# Altium schematic sheet IPOD_LCD.SchDoc
size A3
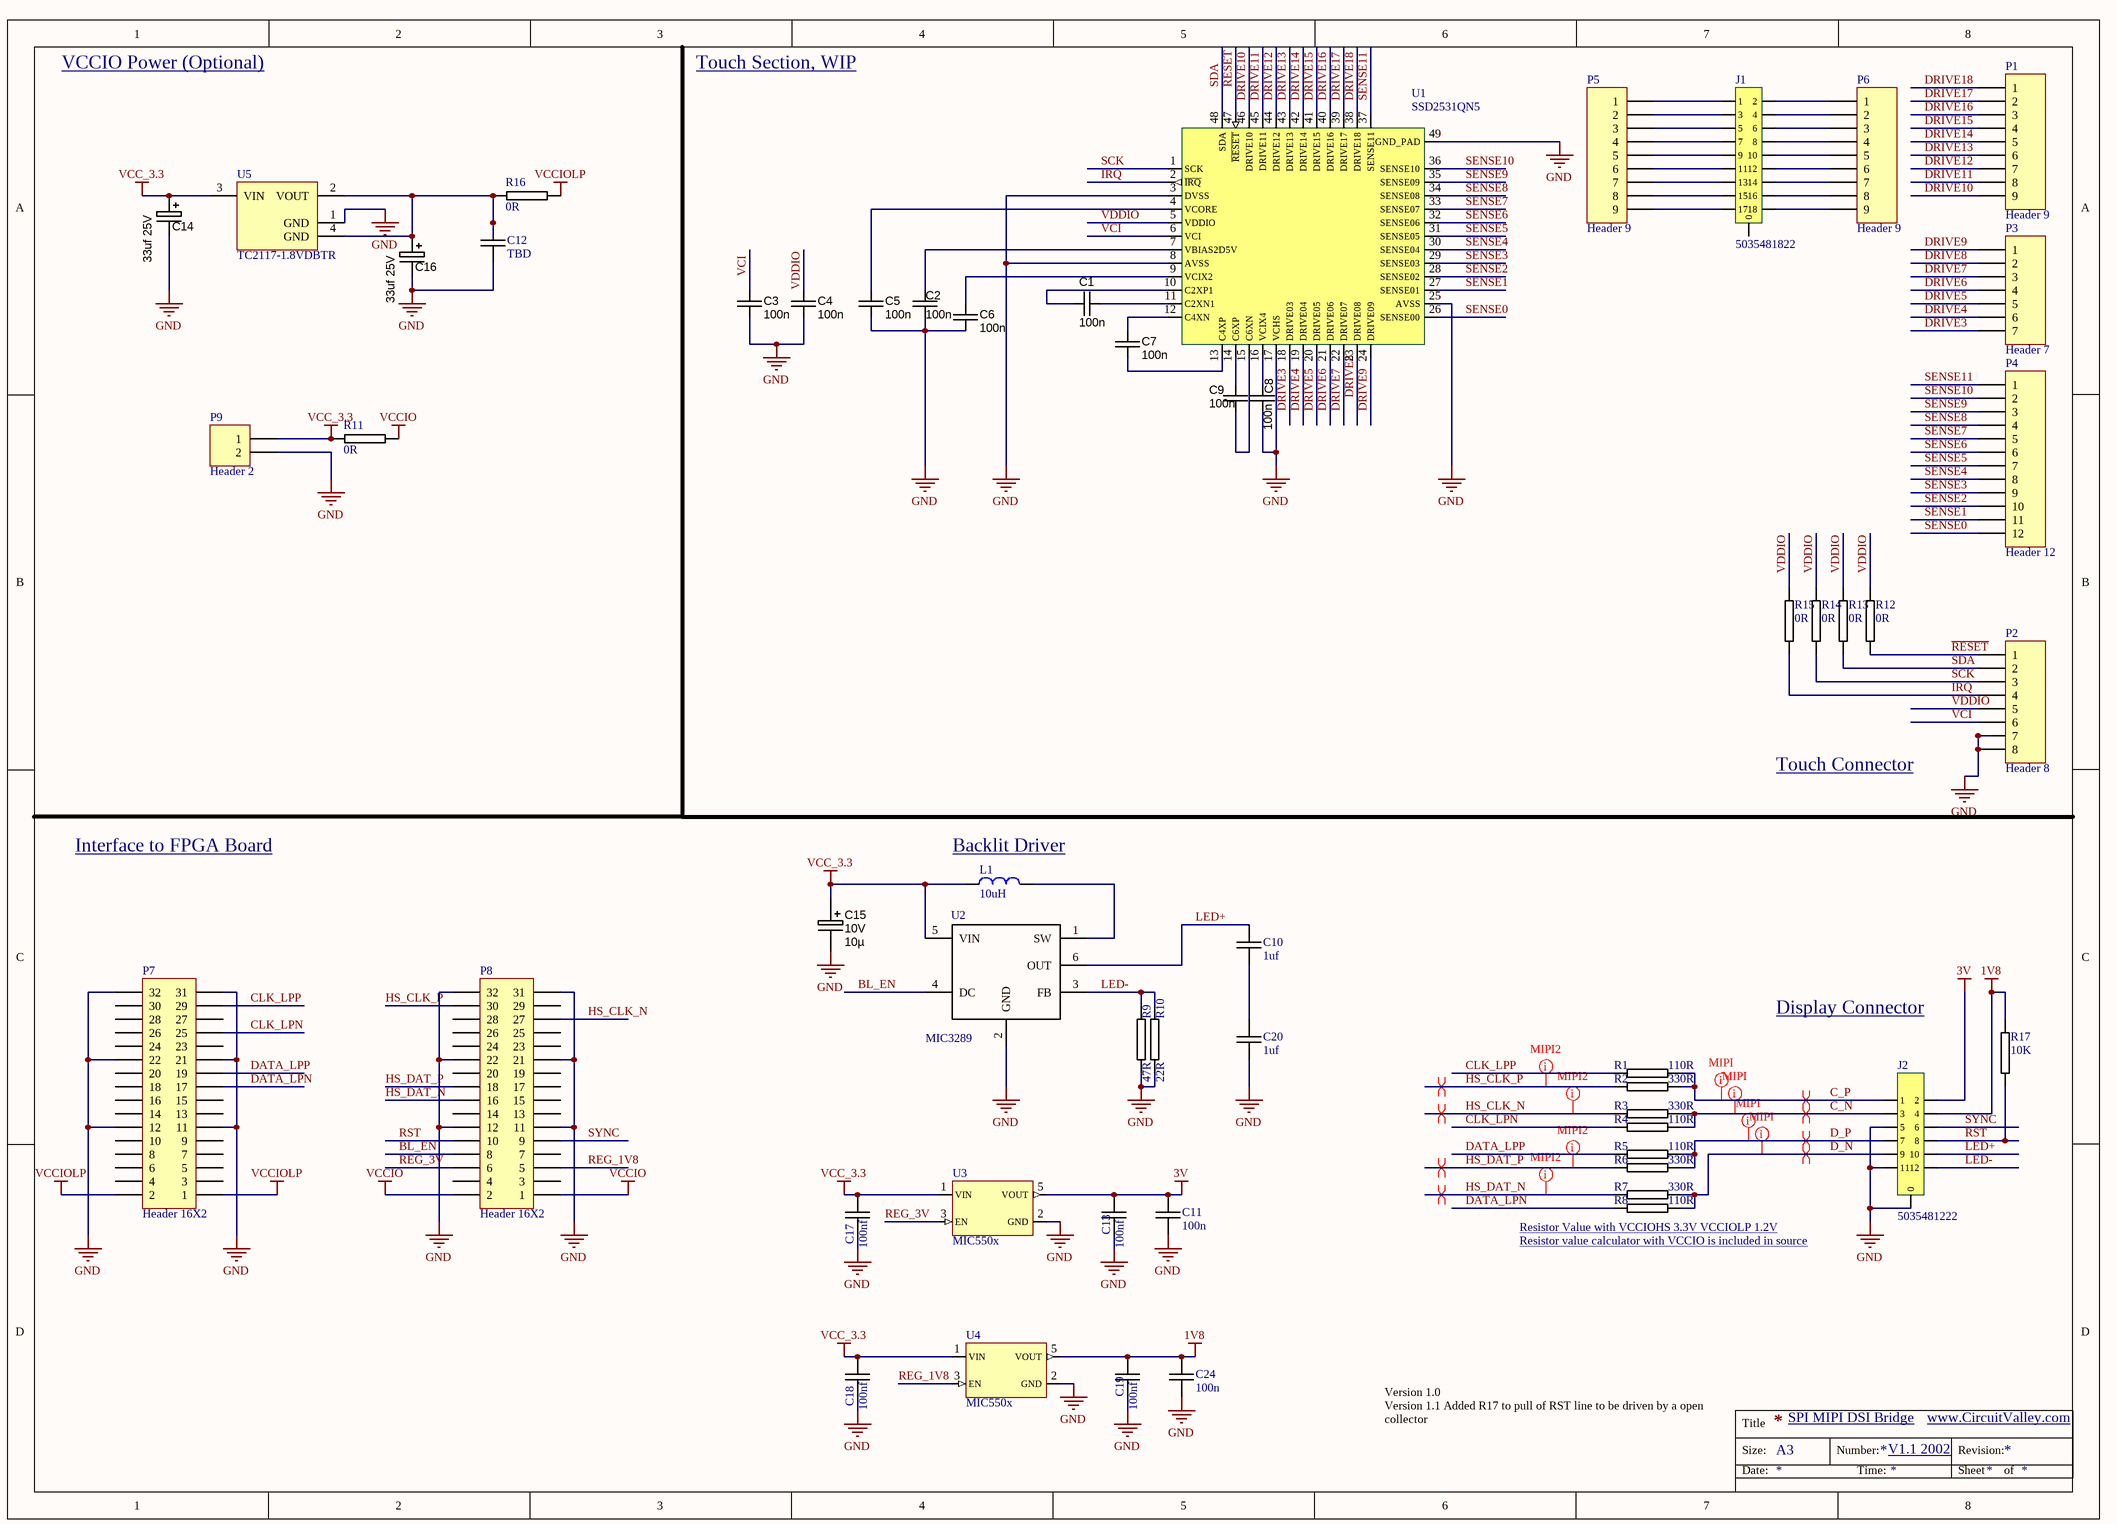
[diagram p0: IPOD_LCD.SchDoc]

## Parts
C1  100n  [CAPC1608N]
C2  100n  [CAPC1608N]
C3  100n  [CAPC1608N]
C4  100n  [CAPC1608N]
C5  100n  [CAPC1608N]
C6  100n  [CAPC1608N]
C7  100n  [CAPC1608N]
C8  100n  [CAPC1608N]
C9  100n  [CAPC1608N]
C10  1uf  [0805C-TBD]
C11  100n  [0805C-TBD]
C12  TBD  [0805C-TBD]
C13  100nf  [0603C-GENERIC]
C14  value 33uf 25V  [CAPMP7343X310N]  (hidden comment: 33uf 20V D)
C15  Ratings: 10V  [CAPMP3528X210N]  (hidden comment: 10µ)
C16  value 33uf 25V  [CAPMP7343X310N]  (hidden comment: 33uf 20V D)
C17  100nf  [0603C-GENERIC]
C18  100nf  [0603C-GENERIC]
C19  100nf  [0603C-GENERIC]
C20  1uf  [0805C-TBD]
C24  100n  [0805C-TBD]
J1  5035481822  [5035481822]
J2  5035481222  [5035481222]
L1  10uH  [IFSC-1515AH-01]
P1  Header 9  [HDR1X9]
P2  Header 8  [HDR1X8]
P3  Header 7  [HDR1X7]
P4  Header 12  [HDR1X12]
P5  Header 9  [HDR1X9]
P6  Header 9  [HDR1X9]
P7  Header 16X2  [HDR2X16]
P8  Header 16X2  [HDR2X16]
P9  Header 2  [HDR1X2]
R1  110R  [0805R-GENERIC]
R2  330R  [0805R-GENERIC]
R3  330R  [0805R-GENERIC]
R4  110R  [0805R-GENERIC]
R5  110R  [0805R-GENERIC]
R6  330R  [0805R-GENERIC]
R7  330R  [0805R-GENERIC]
R8  110R  [0805R-GENERIC]
R9  47R  [0805R-GENERIC]
R10  22R  [0805R-GENERIC]
R11  0R  [0805R-GENERIC]
R12  0R  [0805R-GENERIC]
R13  0R  [0805R-GENERIC]
R14  0R  [0805R-GENERIC]
R15  0R  [0805R-GENERIC]
R16  0R  [0805R-GENERIC]
R17  10K  [0805R-GENERIC]
U1  SSD2531QN5  [QFN48_6x6_0.4]
U2  MIC3289  [SOT23-6]
U3  MIC550x  [SOT23-5]
U4  MIC550x  [SOT23-5]
U5  TC2117-1.8VDBTR  [SOT-223-DB3_N]

## Nets
1V8: C19.2 C24.1 J2.4 R17.2 U4.5(VOUT)
3V: C11.1 C13.2 J2.2 U3.5(VOUT)
GND: C2.2 C3.2 C4.2 C5.2 C6.2 C8.2 C11.2 C12.2 C13.1 C14.2 C15.2 C16.2 C17.1 C18.1 C19.1 C20.2 C24.2 J2.0 J2.5 J2.11 P2.7 P2.8 P7.11 P7.12 P7.21 P7.22 P7.31 P7.32 P8.11 P8.12 P8.21 P8.22 P8.31 P8.32 P9.2 R9.1 R10.1 U1.3(DVSS) U1.8(AVSS) U1.17(VCHS) U1.25(AVSS) U1.49(GND_PAD) U2.2(GND) U3.2(GND) U4.2(GND) U5.1(GND)
VCC_3.3: C14.1 C15.1 C17.2 C18.2 L1.1 P9.1 R11.1 U2.5(VIN) U3.1(VIN) U4.1(VIN) U5.3(VIN)
VCCIO: P8.1 P8.2 R11.2
VCCIOLP: P7.1 P7.2 R16.1
BL_EN: P8.8 U2.4(DC)
C_N: J2.3 R3.2 R4.2
C_P: J2.1 R1.2 R2.2
CLK_LPN: P7.25 R4.1
CLK_LPP: P7.29 R1.1
D_N: J2.9 R7.2 R8.2
D_P: J2.7 R5.2 R6.2
DATA_LPN: P7.17 R8.1
DATA_LPP: P7.19 R5.1
DRIVE3: P3.7 U1.18(DRIVE03)
DRIVE4: P3.6 U1.19(DRIVE04)
DRIVE5: P3.5 U1.20(DRIVE05)
DRIVE6: P3.4 U1.21(DRIVE06)
DRIVE7: P3.3 U1.22(DRIVE07)
DRIVE8: P3.2 U1.23(DRIVE08)
DRIVE9: P3.1 U1.24(DRIVE09)
DRIVE10: P1.9 U1.46(DRIVE10)
DRIVE11: P1.8 U1.45(DRIVE11)
DRIVE12: P1.7 U1.44(DRIVE12)
DRIVE13: P1.6 U1.43(DRIVE13)
DRIVE14: P1.5 U1.42(DRIVE14)
DRIVE15: P1.4 U1.41(DRIVE15)
DRIVE16: P1.3 U1.40(DRIVE16)
DRIVE17: P1.2 U1.39(DRIVE17)
DRIVE18: P1.1 U1.38(DRIVE18)
HS_CLK_N: P8.27 R3.1
HS_CLK_P: P8.30 R2.1
HS_DAT_N: P8.16 R7.1
HS_DAT_P: P8.18 R6.1
~{IRQ}: P2.4 R15.1 U1.2(~{IRQ})
LED+: C10.1 J2.10 U2.6(OUT)
LED-: J2.12 R9.2 R10.2 U2.3(FB)
~{RESET}: P2.1 R12.1 U1.47(~{RESET})
REG_1V8: P8.5 U4.3(EN)
REG_3V: P8.6 U3.3(EN)
RST: J2.8 P8.10 R17.1
SCK: P2.3 R14.1 U1.1(SCK)
SDA: P2.2 R13.1 U1.48(SDA)
SENSE0: P4.12 U1.26(SENSE00)
SENSE1: P4.11 U1.27(SENSE01)
SENSE2: P4.10 U1.28(SENSE02)
SENSE3: P4.9 U1.29(SENSE03)
SENSE4: P4.8 U1.30(SENSE04)
SENSE5: P4.7 U1.31(SENSE05)
SENSE6: P4.6 U1.32(SENSE06)
SENSE7: P4.5 U1.33(SENSE07)
SENSE8: P4.4 U1.34(SENSE08)
SENSE9: P4.3 U1.35(SENSE09)
SENSE10: P4.2 U1.36(SENSE10)
SENSE11: P4.1 U1.37(SENSE11)
SYNC: J2.6 P8.9
VCI: C3.1 P2.6 U1.6(VCI)
VDDIO: C4.1 P2.5 R12.2 R13.2 R14.2 R15.2 U1.5(VDDIO)
NetC1_1: C1.1 U1.11(C2XN1)
NetC1_2: C1.2 U1.10(C2XP1)
NetC2_1: C2.1 U1.7(VBIAS2D5V)
NetC5_1: C5.1 U1.4(VCORE)
NetC6_1: C6.1 U1.9(VCIX2)
NetC7_1: C7.1 U1.12(C4XN)
NetC7_2: C7.2 U1.13(C4XP)
NetC8_1: C8.1 U1.16(VCIX4)
NetC9_1: C9.1 U1.14(C6XP)
NetC9_2: C9.2 U1.15(C6XN)
NetC10_2: C10.2 C20.1
NetC12_1: C12.1 C16.1 R16.2 U5.2(VOUT) U5.4(GND)
NetJ1_1: J1.1 P5.1
NetJ1_2: J1.2 P6.1
NetJ1_3: J1.3 P5.2
NetJ1_4: J1.4 P6.2
NetJ1_5: J1.5 P5.3
NetJ1_6: J1.6 P6.3
NetJ1_7: J1.7 P5.4
NetJ1_8: J1.8 P6.4
NetJ1_9: J1.9 P5.5
NetJ1_10: J1.10 P6.5
NetJ1_11: J1.11 P5.6
NetJ1_12: J1.12 P6.6
NetJ1_13: J1.13 P5.7
NetJ1_14: J1.14 P6.7
NetJ1_15: J1.15 P5.8
NetJ1_16: J1.16 P6.8
NetJ1_17: J1.17 P5.9
NetJ1_18: J1.18 P6.9
NetL1_2: L1.2 U2.1(SW)

Not connected (* = marked no-connect by the designer): J1 19(0); P7 3 4 5 6 7 8 9 10 13 14 15 16 18 20 23 24 26 27 28 30; P8 3 4 7 13 14 15 17 19 20 23 24 25 26 28 29

## Layout directives
net class MIPI: C_N, C_P, D_N, D_P
differential pair: C_N, C_P, D_N, D_P, HS_CLK_N, HS_CLK_P, HS_DAT_N, HS_DAT_P
net class MIPI2: HS_CLK_N, HS_CLK_P, HS_DAT_N, HS_DAT_P

## Notes on the sheet
- VCCIO Power (Optional)
- Touch Section, WIP
- Touch Connector
- Interface to FPGA Board
- (near L1) Backlit Driver
- Display Connector
- (near R8) Resistor Value with VCCIOHS 3.3V VCCIOLP 1.2V
- Resistor value calculator with VCCIO is included in source
- Version 1.0
  Version 1.1 Added R17 to pull of RST line to be driven by a open collector
- SPI MIPI DSI Bridge
- V1.1 2002
- www.CircuitValley.com
- Title
- Size:
- Date:
- A3
- Number:
- Time:
- Revision:
- Sheet
- of

## Library data of the parts
C1-C9 = CAPC_10p_0603_NP0_1%_50V: Capacitor SMD Cer 10pF 5% 50V NP0 0603; Manufacturer 1: Murata Electronics North America; Manufacturer Part Number 1: GRM1885C1H100FA01J; Part: C0603X104K5RAC; Ratings: 50V; NP0; Tolerance: ±5%; Operating Temperature: -55°C ~ 125°C; Package / Case: 0603 (1608 Metric); Size / Dimension: 0.063" L x 0.032" W (1.60mm x 0.81mm); Thickness (Max): 0.035" (0.90mm); Supplier 1: Digi-Key; Supplier Part Number 1: GRM1885C1H100FA01J-ND; Value: 100n
C10-C12 C20 C24 = 0805C-TBD: CAPACITOR 0805 CERAMIC VALUE TO BE DETERMINED
C13 C17-C19 = 0603C-10UF-6V3-X5R-MUR: CAPACITOR 0603 CERAMIC; Manufacturer: Murata Electronics North America; Manufacturer Part Number: GRM188R60J106ME47D; Reel: C24; Supplier 1: Digi-Key; Supplier Part Number 1: 490-3896-2-ND
C14 C16 = CAPT_330u_2917_6V3: Capacitor SMD Tant 330uF 20% 6V3 2917; Manufacturer Part Number: T520D337M006ATE015; Part: TAJD336K020R; Ratings: 6.3V; Material: Solid Tantalum; ESR (Equivalent Series Resistance): 15 mOhm; Package / Case: 2917 (7343 Metric); Tolerance: ±20%; Operating Temperature: -55°C ~ 125°C; Size / Dimension: 0.287" L x 0.169" W (7.30mm x 4.30mm); Height - Seated (Max): 0.122" (3.10mm); Manufacturer Size Code: D; Supplier 1: Digi-Key; Supplier Part Number 1: 399-4052-1-ND; ComponentLink1URL: http://www.kemet.com/datasheets&T520D337M006ATE015; ComponentLink1Description: T520D Datasheet
C15 = CAPT_47u_1210_6V3: Capacitor SMD Tantalum 47uF 20% 6.3V 1210; Manufacturer 1: AVX Corporation; Manufacturer Part Number 1: TCJB476M006R0070; Manufacturer Size Code: B; Voltage - Rated: 6V3; ESR (Equivalent Series Resistance): 70.0 mOhm; Type: Molded; Package / Case: 1210 (3528 Metric); Tolerance: ±20%; Material: Tantalum; Supplier 1: Digi-Key; Supplier Part Number 1: 478-3139-1-ND; Operating Temperature: -55°C ~ 125°C; Size / Dimension: 0.138" L x 0.110" W (3.50mm x 2.80mm); Height - Seated (Max): 0.083" (2.10mm); ComponentLink1URL: http://www.avx.com/docs/Catalogs/tcj.pdf; ComponentLink1Description: http://www.avx.com/docs/Catalogs/tcj.pdf; Value: 10µ
J1 = 5035481822: 5035481822 18 Pin Ipod Touch
J2 = 5035481222: 5035481222 12 Ipod lcd
L1 = inductor_smd
P1 P5 P6 = Header 9: Header, 9-Pin; LatestRevisionDate: 17-Jul-2002; LatestRevisionNote: Re-released for DXP Platform.; Publisher: Altium Limited
P2 = Header 8: Header, 8-Pin; LatestRevisionDate: 17-Jul-2002; LatestRevisionNote: Re-released for DXP Platform.; Publisher: Altium Limited
P3 = Header 7: Header, 7-Pin; LatestRevisionDate: 17-Jul-2002; LatestRevisionNote: Re-released for DXP Platform.; Publisher: Altium Limited
P4 = Header 12: Header, 12-Pin; LatestRevisionDate: 17-Jul-2002; LatestRevisionNote: Re-released for DXP Platform.; Publisher: Altium Limited
P7 P8 = Header 16X2: Header, 16-Pin, Dual row; LatestRevisionDate: 17-Jul-2002; LatestRevisionNote: Re-released for DXP Platform.; Publisher: Altium Limited
P9 = Header 2: Header, 2-Pin; LatestRevisionDate: 17-Jul-2002; LatestRevisionNote: Re-released for DXP Platform.; Publisher: Altium Limited
R1-R17 = 0805R-0R: RESISTOR 0805 1 WATT
U5 = TC2117-1.8VDBTR: 800 mA Fixed Low Dropout Positive Regulator, 3-Pin SOT-223, Extended Temperature, Tape and Reel; Published: 29-Jan-2009; DatasheetVersion: revC, Oct-2006; PackageVersion: revBB, Aug-2009; PackageReference: SOT-223-DB3; Publisher: Altium Limited; PackageDescription: 3-Lead Plastic Small Outline Transistor (DB) [SOT-223]; Supplier 1: Digi-Key; Supplier Part Number 1: TC2117-1.8VDBTR-ND; ComponentLink1Description: Datasheet; ComponentLink1URL: http://ww1.microchip.com/downloads/en/DeviceDoc/21665c.pdf; ComponentLink2Description: Packaging Specification; ComponentLink2URL: http://www.microchip.com/stellent/groups/techpub_sg/documents/packagingspec/en012702.pdf; ComponentLink3Description: Microchip.com Home; ComponentLink3URL: http://www.microchip.com/
U2 = MIC3289: Supplier 1: Digi-Key; Supplier Part Number 1: 576-3041-2-ND